# Altium project Power_PCB.PrjPcb
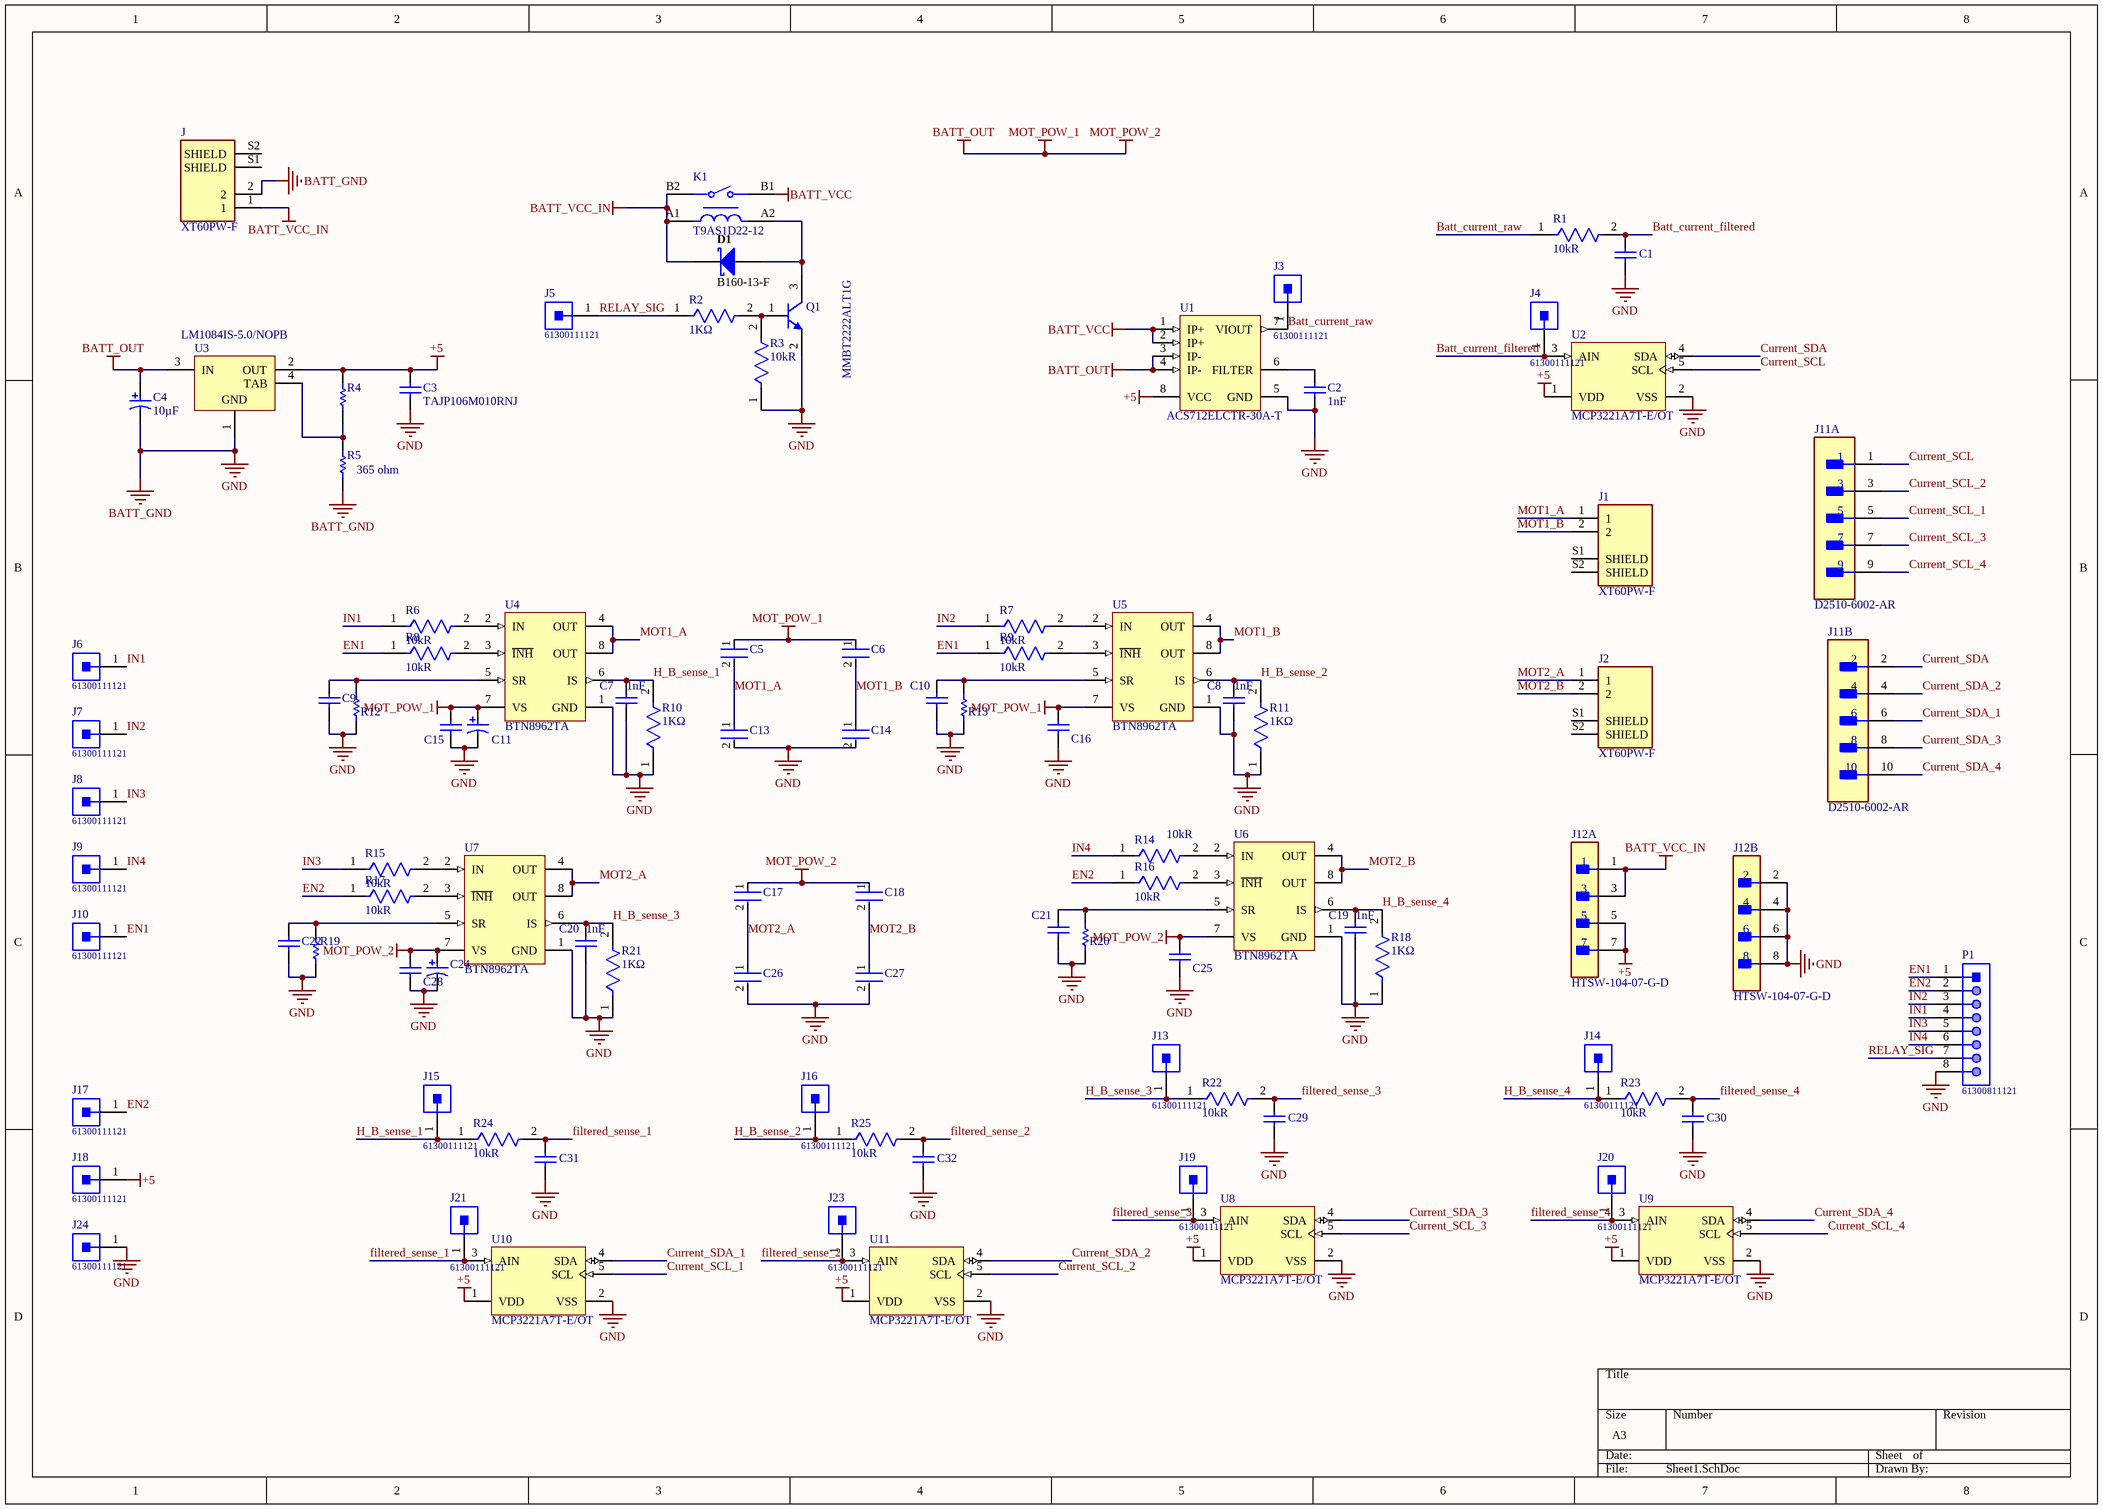
[diagram p0: Sheet1.SchDoc]
1 sheet, 94 parts. Net scope: global (net labels, ports and power ports of the same name join across sheets).
Board file: PCB1.PcbDoc

## Sheet Sheet1.SchDoc
size A3

### Parts
C1  GRM188R60J106ME47D  [CAPC1608X90X35NL10T15]  (value not drawn)
C2  1nF  [CAPC1608X95X40LL15T15]
C3  TAJP106M010RNJ  [CAPC2113X120X50ML20T30]
C4  Capacitance: 10µF  [PNSC-FK-V-B_V]  (hidden comment: EEE-FK1V100UR)
C5  CC0805KRX7R7BB224  [FP-CC0805-0_85-MFG]  (value not drawn)
C6  CC0805KRX7R7BB224  [FP-CC0805-0_85-MFG]  (value not drawn)
C7  1nF  [CAPC1608X95X40LL15T15]
C8  1nF  [CAPC1608X95X40LL15T15]
C9  0603YC104KAZ2A  [CAPC1608X90X35ML15T15]  (value not drawn)
C10  0603YC104KAZ2A  [CAPC1608X90X35ML15T15]  (value not drawn)
C11  EEEFP1E471AP  [PNSC-FP-V-G_V]  (value not drawn)
C13  CC0805KRX7R7BB224  [FP-CC0805-0_85-MFG]  (value not drawn)
C14  CC0805KRX7R7BB224  [FP-CC0805-0_85-MFG]  (value not drawn)
C15  0603YC104KAZ2A  [CAPC1608X90X35ML15T15]  (value not drawn)
C16  0603YC104KAZ2A  [CAPC1608X90X35ML15T15]  (value not drawn)
C17  CC0805KRX7R7BB224  [FP-CC0805-0_85-MFG]  (value not drawn)
C18  CC0805KRX7R7BB224  [FP-CC0805-0_85-MFG]  (value not drawn)
C19  1nF  [CAPC1608X95X40LL15T15]
C20  1nF  [CAPC1608X95X40LL15T15]
C21  0603YC104KAZ2A  [CAPC1608X90X35ML15T15]  (value not drawn)
C22  0603YC104KAZ2A  [CAPC1608X90X35ML15T15]  (value not drawn)
C24  EEEFP1E471AP  [PNSC-FP-V-G_V]  (value not drawn)
C25  0603YC104KAZ2A  [CAPC1608X90X35ML15T15]  (value not drawn)
C26  CC0805KRX7R7BB224  [FP-CC0805-0_85-MFG]  (value not drawn)
C27  CC0805KRX7R7BB224  [FP-CC0805-0_85-MFG]  (value not drawn)
C28  0603YC104KAZ2A  [CAPC1608X90X35ML15T15]  (value not drawn)
C29  GRM188R60J106ME47D  [CAPC1608X90X35NL10T15]  (value not drawn)
C30  GRM188R60J106ME47D  [CAPC1608X90X35NL10T15]  (value not drawn)
C31  GRM188R60J106ME47D  [CAPC1608X90X35NL10T15]  (value not drawn)
C32  GRM188R60J106ME47D  [CAPC1608X90X35NL10T15]  (value not drawn)
D1  B160-13-F  [DIOD-B1X0-2_V]
J  XT60PW-F  [AMASS_XT60PW-F]
J1  XT60PW-F  [AMASS_XT60PW-F]
J2  XT60PW-F  [AMASS_XT60PW-F]
J3  61300111121  [61300111121]
J4  61300111121  [61300111121]
J5  61300111121  [61300111121]
J6  61300111121  [61300111121]
J7  61300111121  [61300111121]
J8  61300111121  [61300111121]
J9  61300111121  [61300111121]
J10  61300111121  [61300111121]
J11  D2510-6002-AR  [FP-D2510-6002-AR-MFG]  (parts A,B of 2)
J12  HTSW-104-07-G-D  [FP-HTSW-104-07-G-D-MFG]  (parts A,B of 2)
J13  61300111121  [61300111121]
J14  61300111121  [61300111121]
J15  61300111121  [61300111121]
J16  61300111121  [61300111121]
J17  61300111121  [61300111121]
J18  61300111121  [61300111121]
J19  61300111121  [61300111121]
J20  61300111121  [61300111121]
J21  61300111121  [61300111121]
J23  61300111121  [61300111121]
J24  61300111121  [61300111121]
K1  T9AS1D22-12  [FP-T9AS1D22-12-MFG]
P1  61300811121  [61300811121]
Q1  MMBT2222ALT1G  [ONSC-SOT-23-3-318-08_V]
R1  Resistance: 10kR  [FP-MCT0603-IPC_B]  (hidden comment: MCT0603MD1002BP100)
R2  value 1KΩ  [FP-RP73P-1J-MFG]  (hidden comment: RP73PF1J1K0BTDF)
R3  Resistance: 10kR  [FP-MCT0603-IPC_B]  (hidden comment: MCT0603MD1002BP100)
R4  ERJ-3EKF1210V  [RESC1608X55X30ML15T15]  (value not drawn)
R5  365 ohm  [RESC1608X55X30LL15T15]
R6  Resistance: 10kR  [FP-MCT0603-IPC_B]  (hidden comment: MCT0603MD1002BP100)
R7  Resistance: 10kR  [FP-MCT0603-IPC_B]  (hidden comment: MCT0603MD1002BP100)
R8  Resistance: 10kR  [FP-MCT0603-IPC_B]  (hidden comment: MCT0603MD1002BP100)
R9  Resistance: 10kR  [FP-MCT0603-IPC_B]  (hidden comment: MCT0603MD1002BP100)
R10  value 1KΩ  [FP-RP73P-1J-MFG]  (hidden comment: RP73PF1J1K0BTDF)
R11  value 1KΩ  [FP-RP73P-1J-MFG]  (hidden comment: RP73PF1J1K0BTDF)
R12  CRCW0603510RFKEA  [RESC1609X50X30NL10T20]  (value not drawn)
R13  CRCW0603510RFKEA  [RESC1609X50X30NL10T20]  (value not drawn)
R14  Resistance: 10kR  [FP-MCT0603-IPC_B]  (hidden comment: MCT0603MD1002BP100)
R15  Resistance: 10kR  [FP-MCT0603-IPC_B]  (hidden comment: MCT0603MD1002BP100)
R16  Resistance: 10kR  [FP-MCT0603-IPC_B]  (hidden comment: MCT0603MD1002BP100)
R17  Resistance: 10kR  [FP-MCT0603-IPC_B]  (hidden comment: MCT0603MD1002BP100)
R18  value 1KΩ  [FP-RP73P-1J-MFG]  (hidden comment: RP73PF1J1K0BTDF)
R19  CRCW0603510RFKEA  [RESC1609X50X30NL10T20]  (value not drawn)
R20  CRCW0603510RFKEA  [RESC1609X50X30NL10T20]  (value not drawn)
R21  value 1KΩ  [FP-RP73P-1J-MFG]  (hidden comment: RP73PF1J1K0BTDF)
R22  Resistance: 10kR  [FP-MCT0603-IPC_B]  (hidden comment: MCT0603MD1002BP100)
R23  Resistance: 10kR  [FP-MCT0603-IPC_B]  (hidden comment: MCT0603MD1002BP100)
R24  Resistance: 10kR  [FP-MCT0603-IPC_B]  (hidden comment: MCT0603MD1002BP100)
R25  Resistance: 10kR  [FP-MCT0603-IPC_B]  (hidden comment: MCT0603MD1002BP100)
U1  ACS712ELCTR-30A-T  [ALEG-LC-8_V]
U2  MCP3221A7T-E/OT  [SOT-23-OT5_N]
U3  LM1084IS-5.0/NOPB  [KTT0003B_L]
U4  BTN8962TA  [INF-PG-TO263-7-1_N]
U5  BTN8962TA  [INF-PG-TO263-7-1_N]
U6  BTN8962TA  [INF-PG-TO263-7-1_N]
U7  BTN8962TA  [INF-PG-TO263-7-1_N]
U8  MCP3221A7T-E/OT  [SOT-23-OT5_N]
U9  MCP3221A7T-E/OT  [SOT-23-OT5_N]
U10  MCP3221A7T-E/OT  [SOT-23-OT5_N]
U11  MCP3221A7T-E/OT  [SOT-23-OT5_N]

### Nets
+5: C3.2 J12.5 J12.7 J18.1 R4.2 U1.8(VCC) U2.1(VDD) U3.2(OUT) U8.1(VDD) U9.1(VDD) U10.1(VDD) U11.1(VDD)
BATT_GND: C1.1 C2.1 C3.1 C4.2 C7.1 C8.1 C9.1 C10.1 C11.2 C13.2 C14.2 C15.2 C16.2 C19.1 C20.1 C21.1 C22.1 C24.2 C25.2 C26.2 C27.2 C28.2 C29.1 C30.1 C31.1 C32.1 J.2 J12.2 J12.4 J12.6 J12.8 J24.1 P1.8 Q1.2(E) R3.1 R5.1 R10.1 R11.1 R12.1 R13.1 R18.1 R19.1 R20.1 R21.1 U1.5(GND) U2.2(VSS) U3.1(GND) U4.1(GND) U5.1(GND) U6.1(GND) U7.1(GND) U8.2(VSS) U9.2(VSS) U10.2(VSS) U11.2(VSS)  [also labelled GND]
BATT_OUT: C4.1 C5.1 C6.1 C11.1 C15.1 C16.1 C17.1 C18.1 C24.1 C25.1 C28.1 U1.3(IP-) U1.4(IP-) U3.3(IN) U4.7(VS) U5.7(VS) U6.7(VS) U7.7(VS)  [also labelled MOT_POW_1, MOT_POW_2]
BATT_VCC: K1.B1 U1.1(IP+) U1.2(IP+)
BATT_VCC_IN: D1.1(K) J.1 J12.1 J12.3 K1.A1 K1.B2
Batt_current_filtered: C1.2 J4.1 R1.2 U2.3(AIN)
Batt_current_raw: J3.1 R1.1 U1.7(VIOUT)
Current_SCL: J11.1 U2.5(SCL)
Current_SCL_1: J11.5 U10.5(SCL)
Current_SCL_2: J11.3 U11.5(SCL)
Current_SCL_3: J11.7 U8.5(SCL)
Current_SCL_4: J11.9 U9.5(SCL)
Current_SDA: J11.2 U2.4(SDA)
Current_SDA_1: J11.6 U10.4(SDA)
Current_SDA_2: J11.4 U11.4(SDA)
Current_SDA_3: J11.8 U8.4(SDA)
Current_SDA_4: J11.10 U9.4(SDA)
EN1: J10.1 P1.1 R8.1 R9.1
EN2: J17.1 P1.2 R16.1 R17.1
filtered_sense_1: C31.2 J21.1 R24.2 U10.3(AIN)
filtered_sense_2: C32.2 J23.1 R25.2 U11.3(AIN)
filtered_sense_3: C29.2 J19.1 R22.2 U8.3(AIN)
filtered_sense_4: C30.2 J20.1 R23.2 U9.3(AIN)
H_B_sense_1: C7.2 J15.1 R10.2 R24.1 U4.6(IS)
H_B_sense_2: C8.2 J16.1 R11.2 R25.1 U5.6(IS)
H_B_sense_3: C20.2 J13.1 R21.2 R22.1 U7.6(IS)
H_B_sense_4: C19.2 J14.1 R18.2 R23.1 U6.6(IS)
IN1: J6.1 P1.4 R6.1
IN2: J7.1 P1.3 R7.1
IN3: J8.1 P1.5 R15.1
IN4: J9.1 P1.6 R14.1
MOT1_A: C5.2 C13.1 J1.1 U4.4(OUT) U4.8(OUT)
MOT1_B: C6.2 C14.1 J1.2 U5.4(OUT) U5.8(OUT)
MOT2_A: C17.2 C26.1 J2.1 U7.4(OUT) U7.8(OUT)
MOT2_B: C18.2 C27.1 J2.2 U6.4(OUT) U6.8(OUT)
RELAY_SIG: J5.1 P1.7 R2.1
NetC2_2: C2.2 U1.6(FILTER)
NetC9_2: C9.2 R12.2 U4.5(SR)
NetC10_2: C10.2 R13.2 U5.5(SR)
NetC21_2: C21.2 R20.2 U6.5(SR)
NetC22_2: C22.2 R19.2 U7.5(SR)
NetD1_2: D1.2(A) K1.A2 Q1.3(C)
NetQ1_1: Q1.1(B) R2.2 R3.2
NetR4_1: R4.1 R5.2 U3.4(TAB)
NetR6_2: R6.2 U4.2(IN)
NetR7_2: R7.2 U5.2(IN)
NetR8_2: R8.2 U4.3(~{INH})
NetR9_2: R9.2 U5.3(~{INH})
NetR14_2: R14.2 U6.2(IN)
NetR15_2: R15.2 U7.2(IN)
NetR16_2: R16.2 U6.3(~{INH})
NetR17_2: R17.2 U7.3(~{INH})

Not connected (* = marked no-connect by the designer): J S1(SHIELD) S2(SHIELD); J1 S1(SHIELD) S2(SHIELD); J2 S1(SHIELD) S2(SHIELD)

### Library data of the parts
C1 C29-C32 = CMP-2006-02792-1: Manufacturer: Murata; Part Number: GRM188R60J106ME47D
C2 C7 C8 C19 C20 = CMP-2006-02121-1: Part Number: VJ0603Y102KXACW1BC; Manufacturer: Vitramon
C3 = CMP-2007-04028-1: Manufacturer: AVX Interconnect / Elco; Part Number: TAJP106M010RNJ
C4 = CMP-2000-06211-1: Aluminum Electrolytic Capacitor, 10 uF, +/- 20%, 35 V, 2-Pin SMD (Size Code B), -55 to 105 degC, RoHS, Tape and Reel; Manufacturer: Panasonic; Impedance: 1.35O; Rated Voltage: 35V; Lifetime@Temperature: 2000Hrs@105°C; Ripple Current: 90mA; Type: Can; Manufacturer URL: http://www.panasonic.com/; Package Reference: FK-V-B; Operating Temp Range: -55to+105°C; Series: FK; Datasheet URL: http://industrial.panasonic.com/cdbs/www-data/pdf/RDE0000/ABA0000C1181.pdf; Mounting Technology: SurfaceMount; Package URL: http://industrial.panasonic.com/cdbs/www-data/pdf/RDE0000/DME0000COL48.pdf; Package Description: 2-Pin Electrolytic Aluminum Capacitor, Body 4.3 x 4.3 mm; Datasheet Version: 03/2016; Case Size/Dimension: Ø4x5.8mm; Operating Temp-Max: 105°C
C5 C6 C13 C14 C17 C18 C26 C27 = CMP-03422-000685-1: CAP CER 0.22UF 16V X7R 0805; Manufacturer: Yageo; Tolerance: 0.1; Material: Ceramic; Capacitance: 220 nF; Value: 220 nF; Device Class L2: Capacitors; Temperature Range Low: -30°C; Device Class L3: Ceramic Capacitors; Digikey Description: CAP CER 0.22UF 16V X7R 0805; Temperature Range High: +85°C; Temperature Characteristic: X7R; Temperature: -30°C to +85°C; Device Class L1: Passive Components; Category: Cap; Footprint Url: http://www.yageo.com/exep/pages/download/literatures/UPY-C_GEN_24.pdf; Voltage Rating: 16 V; Octopart: https://octopart.com/cc0805krx7r7bb224-yageo-8376564; Height: 0.95mm; ComponentLink2Description: Datasheet; Ipc Land Pattern Name: CAPC200125X85; RoHS: TRUE; Lead Free: Yes; Mouser Description: Multilayer Ceramic Capacitors MLCC - SMD/SMT 220nF 16V X7R 10%; Package: CC0805-0.85; Manufacturer Part Number: CC0805KRX7R7BB224; ComponentLink2URL: http://www.yageo.com/documents/recent/UPY-GPHC_Y5V_6.3V-to-50V_8.pdf; Automotive: No
C9 C10 C15 C16 C21 C22 C25 C28 = CMP-2006-04496-1: Manufacturer: AVX Interconnect / Elco; Part Number: 0603YC104KAZ2A
C11 C24 = CMP-2000-06214-1: Aluminum Electrolytic Capacitor, 470 uF, +/- 20%, 25 V, 2-Pin SMD (Size Code G), -55 to 105 degC, RoHS, Tape and Reel; Manufacturer: Panasonic; Capacitance: 470µF; Ripple Current: 1190mA; ESR (Equivalent Series Resistance): 0.06O; Type: Can; Rated Voltage: 25V; Lifetime@Temperature: 2000Hrs@105°C; Package Reference: FP-V-G; Case Size/Dimension: Ø10x10.2mm; Mounting Technology: SurfaceMount; Datasheet Version: 03/2016; Datasheet URL: http://industrial.panasonic.com/cdbs/www-data/pdf/RDE0000/ABA0000C1184.pdf; Series: FP; Operating Temp Range: -55to+105°C; Operating Temp-Max: 105°C; Package URL: http://industrial.panasonic.com/cdbs/www-data/pdf/RDE0000/DME0000COL48.pdf; Package Description: 2-Pin Electrolytic Aluminum Capacitor, Body 10.3 x 10.3 mm; Manufacturer URL: http://www.panasonic.com/
D1 = CMP-2000-05885-1: Surface Mount Schottky Barrier Rectifier, 1 A, -65 to 150 degC, 2-Pin SMA, RoHS, Tape and Reel; IFSM Max: 30A; If - Forward Current: 1A; Ir - Reverse Current: 500uA; Brand: DiodesIncorporated; Configuration: Single; VRRM Max: 60V; Unit Weight: 0.002258oz; Vf - Forward Voltage: 0.7V; Mounting Style: SMD/SMT; Length: 4.6mm; Package / Case: SMA; Package Reference: SMA; Packaging: Reel; Minimum Operating Temperature: -65C; Product: SchottkyDiodes; Datasheet URL: http://www.diodes.com/_files/datasheets/ds13002.pdf; Maximum Operating Temperature: +150C; Termination Style: SMD/SMT; IO: 1A; Product Category: SchottkyDiodes&Rectifiers; Manufacturer URL: http://www.diodes.com/; RoHS: True; Width: 2.92mm; Factory Pack Quantity: 5000; Type: SchottkyBarrierRectifier; Datasheet Version: Rev. 18-2, 05/2013; Operating Temperature Range: -65Cto+150C; Height: 2.1mm; Package Description: 2-Pin Surface Mount Device, Body 4.3 x 2.605 mm; Mounting Technology: SurfaceMount; Vrrm - Repetitive Reverse Voltage: 60V; Series: B160; Manufacturer: DiodesIncorporated; Ifsm - Forward Surge Current: 30A; Technology: Si
J J1 J2 = XT60PW-F: Socket DC Supply Connector Female; MF: AMASS; Availability: Unavailable; SnapEDA_Link: https://www.snapeda.com/parts/XT60PW-F/AMASS/view-part/2890674/?ref=snap; MP: XT60PW-F; Value: *; Price: None; Package: Package; BuyPart: https://www.snapeda.com/parts/XT60PW-F/AMASS/view-part/2890674/?ref=eda
J3-J10 J13-J21 J23 J24 = CMP-1502-01058-1: THT Vertical Pin Header WR-PHD, Pitch 2.54 mm, Single Row, 1 pins; Manufacturer: Wurth Elektronik; Gender: Male; Working Voltage: 250VAC; Withstanding Voltage: 500VAC; Pin Number: 1; Contact Resistance: 20mOhm; Rated Current: 3A; Pitch: 2.54mm; Mounting Technology: THT; Datasheet URL: https://katalog.we-online.de/em/datasheet/6130xx11121.pdf; Manufacturer URL: http://www.we-online.de; Operating Temperature: -40to105degC; Publisher: WurthElektronik; Part Number: 61300111121; Row Number: Single; Package Reference: 61300111121; Orientation: Vertical; Packaging: Bag
J11 = CMP-05379-000002-1: CONN HEADER VERT 10POS 2.54MM; Manufacturer: 3M; Conn Gender: Male; Number Of Contacts: 10; Conn Orientation: Straight; Current Rating: 1.75A; Temperature: -55°C to +105°C; Temperature Range High: +105°C; Automotive: No; Device Class L2: Headers and Wire Housings; Mouser Description: Headers & Wire Housings 10P 4WALL HEADER STRT L-PRO THRU-HOLE; Category: Conn; Lead Free: Yes; Manufacturer Part Number: D2510-6002-AR; Octopart: https://octopart.com/d2510-6002-ar-3m-8399032; Temperature Range Low: -55°C; ComponentLink2URL: http://multimedia.3m.com/mws/media/485877O/3m-four-wall-header-d2500-series-ts-2244.pdf; Package: D2510-6002-AR; RoHS: TRUE; Pitch: 2.54mm; Contact Material: Gold,Nickel; Height: 10.04mm; ComponentLink2Description: Datasheet; Device Class L1: Connectors; Digikey Description: CONN HEADER VERT 10POS 2.54MM; Device Class L3: unset; Number Of Rows: 2
J12 = CMP-02766-000066-1: CONN HEADER VERT 8POS 2.54MM; Manufacturer: Samtec; Conn Orientation: Straight; Voltage Rating: 550V; Current Rating: 6.3A; Description: Connector Header Through Hole 8 position 0.100" (2.54mm); Number Of Contacts: 8; Conn Gender: Male; Lead Free: Yes; ComponentLink2URL: http://suddendocs.samtec.com/prints/htsw-xxx-xx-xxx-x-xx-xx-xx-mkt.pdf; Category: Conn; Octopart: https://octopart.com/htsw-104-07-g-d-samtec-10613822; RoHS: TRUE; Device Class L2: Headers and Wire Housings; Device Class L3: unset; ComponentLink2Description: Datasheet; Number Of Rows: 2; Digikey Description: CONN HEADER VERT 8POS 2.54MM; Temperature Range Low: -55°C; Temperature: -55°C to +125°C; Automotive: No; Temperature Range High: +125°C; Footprint Url: http://suddendocs.samtec.com/prints/htsw-xxx-xx-xxx-x-xx-xx-xx-footprint.pdf; Device Class L1: Connectors; Pitch: 2.54mm; Manufacturer Part Number: HTSW-104-07-G-D; Package: HTSW-104-07-G-D; Contact Material: Gold,Nickel; Height: 8.71mm
K1 = CMP-03395-000121-1: RELAY GEN PURPOSE SPST 30A 12V; Manufacturer: TE Connectivity; Coil Type: Non-Latching; Number Of Contacts: 1; Coil Resistance: 144Ω; Coil Power: 1W; Lead Free: Yes; Coil Voltage: 12V; Throw Configuration: SPST; Automotive: No; Temperature Range Low: -55°C; Ambient Temperature Range Low: -55°C; Category: Relay; Digikey Description: RELAY GEN PURPOSE SPST 30A 12V; RoHS: TRUE; ComponentLink2Description: Datasheet; Device Class L1: Electromechanical; Current Rating: 30A; Manufacturer Part Number: T9AS1D22-12; Device Class L2: Relays; Device Class L3: Power Relays; Octopart: https://octopart.com/t9as1d22-12-te+connectivity-46521723; Height: 27.94mm; Temperature Range High: +105°C; Temperature: -55°C to +105°C; Ambient Temperature Range High: +85°C; Package: T9AS1D22-12; ComponentLink2URL: https://www.te.com/commerce/DocumentDelivery/DDEController?Action=showdoc&DocId=Customer+Drawing%7FT9AS1D22-12%7FG%7Fpdf%7FEnglish%7FENG_CD_T9AS1D22-12_G.pdf%7F1-1419104-7; Switching Current: 30A
P1 = CMP-1502-01076-1: THT Vertical Pin Header WR-PHD, Pitch 2.54 mm, Single Row, 8 pins; Manufacturer: Wurth Elektronik; Rated Current: 3A; Pin Number: 8; Working Voltage: 250VAC; Gender: Male; Contact Resistance: 20mOhm; Pitch: 2.54mm; Withstanding Voltage: 500VAC; Publisher: WurthElektronik; Operating Temperature: -40to105degC; Orientation: Vertical; Row Number: Single; Part Number: 61300811121; Package Reference: 61300811121; Mounting Technology: THT; Packaging: Bag; Manufacturer URL: http://www.we-online.de; Datasheet URL: https://katalog.we-online.de/em/datasheet/6130xx11121.pdf
Q1 = CMP-1048-00538-1: General Purpose Transistor, NPN Silicon, 3-Pin SOT-23, Pb-Free, Tape and Reel; Manufacturer: On Semiconductor; fT Min (MHz): 300; IC Continuous (A): 0.6; ComponentLink3URL: http://www.onsemi.cn/pub_link/Collateral/318-08.PDF; PartNumber: MMBT2222ALT1G; RoHS: TRUE; ComponentLink1URL: http://www.onsemi.com/; ComponentLink3Description: Package Specification; ComponentLink2Description: Datasheet; Mounting Technology: Surface Mount; Packing: Tape and Reel; PackageDescription: 3-Pin Small Outline Transistor, Body 2.92 x 1.3 mm, Pitch 0.95 mm; DatasheetVersion: Rev. 10; PackageReference: SOT-23-3-318-08; ComponentLink2URL: http://www.onsemi.cn/pub_link/Collateral/MMBT2222LT1-D.PDF; Polarity: NPN; PackageVersion: Rev. AP, 11/2009; ComponentLink1Description: Manufacturer URL
R1 R3 R6-R9 R14-R17 R22-R25 = CMP-02407-000530-1: RES SMD 100 OHM 1% 1/8W 0603; Voltage Rating (DC): 75V; Max Power Dissipation: 125mW; Tolerance: 0.1%; Temperature Coefficient: 25ppm/°C; Max Operating Temperature: 155°C; Case/Package: 0603; Contact Plating: Tin; Military Standard: Not; Number of Terminations: 2; Min Operating Temperature: -55°C; Radiation Hardening: No; Lead Free: Lead Free; Case Code (Imperial): 0603; Length: 1.55mm; Voltage Rating: 75V; Height: 0.45mm; Features: Automotive AEC-Q200; Case Code (Metric): 1608; REACH SVHC: No SVHC; Packaging: Tape and Reel; Depth: 0.85mm; Width: 0.033inch; Package Quantity: 1; Composition: Thin Film; Power Rating: 125mW
R2 R10 R11 R18 R21 = CMP-03211-004517-1: RES SMD 1K OHM 0.1% 1/6W 0603; Manufacturer: TE Connectivity; Power Rating: 0.166W; Tolerance: 0.001; Temperature Coefficient: 25ppm/°C; Voltage Rating: 100V; Composition: Thin Film; Category: Res; Temperature Range High: +155°C; Device Class L1: Passive Components; Digikey Description: RES SMD 1K OHM 0.1% 1/6W 0603; Lead Free: Yes; RoHS: TRUE; Ipc Land Pattern Name: RESC15580X45; Automotive: No; Temperature: -55°C to +155°C; Height: 0.55mm; ComponentLink2URL: https://www.te.com/commerce/DocumentDelivery/DDEController?Action=srchrtrv&DocNm=1773272&DocType=DS&DocLang=English; Manufacturer Part Number: RP73PF1J1K0BTDF; Resistance: 1KΩ; ComponentLink2Description: Datasheet; Temperature Range Low: -55°C; Octopart: https://octopart.com/rp73pf1j1k0btdf-te+connectivity-45465729; Device Class L3: Chip SMD Resistors; Series: RP73P; Package: RP73P-1J; Device Class L2: Resistors
R4 = CMP-2000-00218-1: Manufacturer: Panasonic; Part Number: ERJ-3EKF1210V
R5 = CMP-2000-00461-1: Part Number: ERJ-3EKF3650V; Manufacturer: Panasonic
R12 R13 R19 R20 = CMP-2000-03439-1: Manufacturer: Vishay Dale; Part Number: CRCW0603510RFKEA
U1 = CMP-2000-04990-1: Linear Current Sensor IC, 4.5 to 5.5 V Supply Voltage, 10 mA Supply Current, -40 to 85 degC, 8-Pin SOIC (LC), RoHS, Tape and Reel; Manufacturer: Allegro Microsystems; SVHC: NoSVHC(19-Dec-2012); Output Current: 10mA; Bandwidth: 80kHz; No. of Pins: 8; Supply Voltage Min: 4.5V; Supply Voltage Max: 5V; Package Reference: LC-8; Sensor Case Style: SOIC; Operating Temperature Max: 85degC; Datasheet Version: Rev. 15, 11/2012; Hall Effect Type: Linear; Package / Case: 8-SOIC; Operating Temperature Range: -40degCto+85degC; Manufacturer URL: http://www.allegromicro.com/; MSL: MSL2-1year; Termination Type: SMD; Package Description: 8-Pin Small Outline Integrated Circuit, Body 4.9 x 3.9 mm, Pitch 1.27 mm; Operating Temperature Min: -40degC; Datasheet URL: https://datasheet.ciiva.com/22693/1691042-22693349.pdf
U2 U8-U11 = CMP-0188-00722-2: Low Power 12-Bit A/D Converter With I2C Interface, 5-Pin SOT-23, Extended Temperature, Tape and Reel; ComponentLink1Description: Manufacturer URL; ComponentLink2URL: http://ww1.microchip.com/downloads/en/DeviceDoc/21732c.pdf; RevisionNote: URLs added.; ComponentLink3URL: http://www.microchip.com/stellent/groups/techpub_sg/documents/packagingspec/en012702.pdf; Code_IPC: SOT23-5; ComponentLink3Description: Package Specification; ComponentLink1URL: http://www.microchip.com/; PackageVersion: revBB, Aug-2009; PackageReference: SOT-23-OT5; ComponentLink2Description: Datasheet; DatasheetVersion: revC, Jul-2006; PackageDescription: 5-Lead Plastic Small Outline Transistor (OT) [SOT-23]
U3 = CMP-0062-00575-5: 5A Low Dropout Positive Regulators, 3-pin TO-263, Pb-Free; Manufacturer: Texas Instruments; High-Reliability: Y; PackageTopMarking: NSUZXYTTE#*LM1084*IS-5.0; CompType: LDO IC; PowerWise: N; ComponentLink1URL: http://www.ti.com/general/docs/lit/getliterature.tsp?genericPartNumber=LM1084&fileType=pdf; PinCount: 3; PackageDescription: TO-263, Molded, .400 x .390 x .180in, 3 Lead, .1in Pitch, Surface Mount; PackageReference: KTT0003B; PartNumber: LM1084IS-5.0/NOPB; Code_JEDEC: MO-169-AA; RoHS: Y; ComponentLink1Description: Datasheet URL
U4-U7 = CMP-1114-00015-1: High Current PN Half Bridge, 5.5 to 40 V, 7 uA Iq, PG-TO263-7, Reel, Green; Manufacturer: Infineon; Diagnosis: OT, OC-failure flag, current sense; Group: NovalithIC; Green: TRUE; ID(lim) (min): 30 A; Iq (typ): 7 uA; RDS (on): 14.2; ID(lim): 42 A; Protect: UV, OT, OC; ComponentLink3Description: Package Specification; Operating Range: 5.5 to 40 V; Packing: Reel; PartNumber: BTN8962TA; PackageDescription: 7-Pin Plastic (Green) Transistor Single Outline Package, 9.25 x 10 mm Body, 1.27 mm Pitch; DatasheetVersion: Rev. 1.0; ComponentLink2URL: http://www.infineon.com/dgdl/BTN8962TA-Data-Sheet-rev10-Infineon.pdf?folderId=db3a30431ff98815012060aedcd46179&fileId=db3a30433fa9412f013fbe2d247a7bf5; Mounting: SMT; ComponentLink1URL: http://www.infineon.com/; ComponentLink1Description: Manufacturer URL; PackageVersion: May-07; ComponentLink2Description: Datasheet; Mounting Technology: Surface Mount; Inhibit: TRUE; Halogen-free: TRUE; PackageReference: PG-TO263-7-1; ComponentLink3URL: http://www.infineon.com/dgdl/BTN8982TA-Data-Sheet-rev10-Infineon.pdf?folderId=db3a30431ff98815012060aedcd46179&fileId=db3a30433fa9412f013fbe32289b7c17&ack=t